# EAGLE design monitor-board (EAGLE 9.2.2)
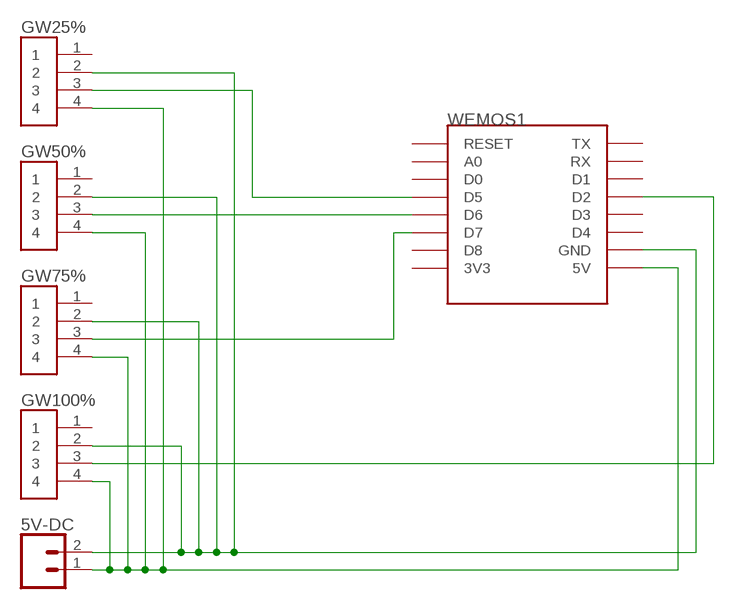
[diagram p0: schematic, sheet 1]

## Parts
5V-DC  CONN_02  [1X02]
GW25%  B4B-XH-A(LF)(SN)  [JST_B4B-XH-A(LF)(SN)]
GW50%  B4B-XH-A(LF)(SN)  [JST_B4B-XH-A(LF)(SN)]
GW75%  B4B-XH-A(LF)(SN)  [JST_B4B-XH-A(LF)(SN)]
GW100%  B4B-XH-A(LF)(SN)  [JST_B4B-XH-A(LF)(SN)]
WEMOS1  WEMOS-D1-MINI  [WEMOS-D1-MINI]

## Nets
N$1: 5V-DC.1 GW25%.4 GW50%.4 GW75%.4 GW100%.4 WEMOS1.5V
N$2: 5V-DC.2 GW25%.2 GW50%.2 GW75%.2 GW100%.2 WEMOS1.GND
N$3: GW25%.3 WEMOS1.D5
N$11: GW100%.3 WEMOS1.D2
N$12: GW75%.3 WEMOS1.D7
N$13: GW50%.3 WEMOS1.D6
Unconnected: GW25%.1 GW50%.1 GW75%.1 GW100%.1 WEMOS1.3V3 WEMOS1.A0 WEMOS1.D0 WEMOS1.D1 WEMOS1.D3 WEMOS1.D4 WEMOS1.D8 WEMOS1.RESET WEMOS1.RX WEMOS1.TX

## Library data of the parts
5V-DC = SparkFun-Connectors:CONN_02: Multi connection point. Often used as Generic Header-pin footprint for 0.1 inch spaced/style header connections On any of the 0.1 inch spaced packages, you can populate with these: Break Away Headers - Straight <https://www.sparkfun.com/products/116> (PRT-00116) Break Away Male Headers - Right Angle <https://www.sparkfun.com/products/553> (PRT-00553) Female Headers <https://www.sparkfun.com/products/115> (PRT-00115) Break Away Headers - Machine Pin <https://www.sparkfun.com/products/117> (PRT-00117) Break Away Female Headers - Swiss Machine Pin <https://www.sparkfun.com/products/743> (PRT-00743) For SCREWTERMINALS and SPRING TERMINALS visit here: Screw Terimnals on SparkFun.com <https://www.sparkfun.com/search/results?term=Screw+Terminals> (5mm/3.5mm/2.54mm spacing) This device is also useful as a general connection point to wire up your design to another part of your project. Our various solder wires solder well into these plated through hole pads. Hook-Up Wire - Assortment (Stranded, 22 AWG) <https://www.sparkfun.com/products/11375> (PRT-11375) Hook-Up Wire - Assortment (Solid Core, 22 AWG) <https://www.sparkfun.com/products/11367> (PRT-11367) View the entire wire category on our website here <https://www.sparkfun.com/categories/141> Special notes: Molex polarized connector foot print use with: PRT-08233 with associated crimp pins and housings. 2.54_SCREWTERM for use with PRT-10571. 3.5mm Screw Terminal footprints for PRT-08084 5mm Screw Terminal footprints for use with PRT-08432
GW25% GW50% GW75% GW100% = B4B-XH-A_LF__SN_:B4B-XH-A(LF)(SN): XH Series 4 Position 2.5 mm Pitch Through Hole Crimp Top Entry Shrouded Header; DESCRIPTION: Connector Header Through Hole 4 position 0.098 _2.50mm_; DIGI-KEY_PART_NUMBER: 455-2249-ND; DIGI-KEY_PURCHASE_URL: https://www.digikey.com/product-detail/en/jst-sales-america-inc/B4B-XH-A_LF__SN_/455-2249-ND/1651047?utm_source=snapeda&utm_medium=aggregator&utm_campaign=symbol; MF: JST Sales; MP: B4B-XH-A_LF__SN_; PACKAGE: None
WEMOS1 = esp8266modules:WEMOS-D1-MINI: WeMos.cc D1 mini ESP8266 module

## Net classes
0 default: clearance 0.635 mm

## Board
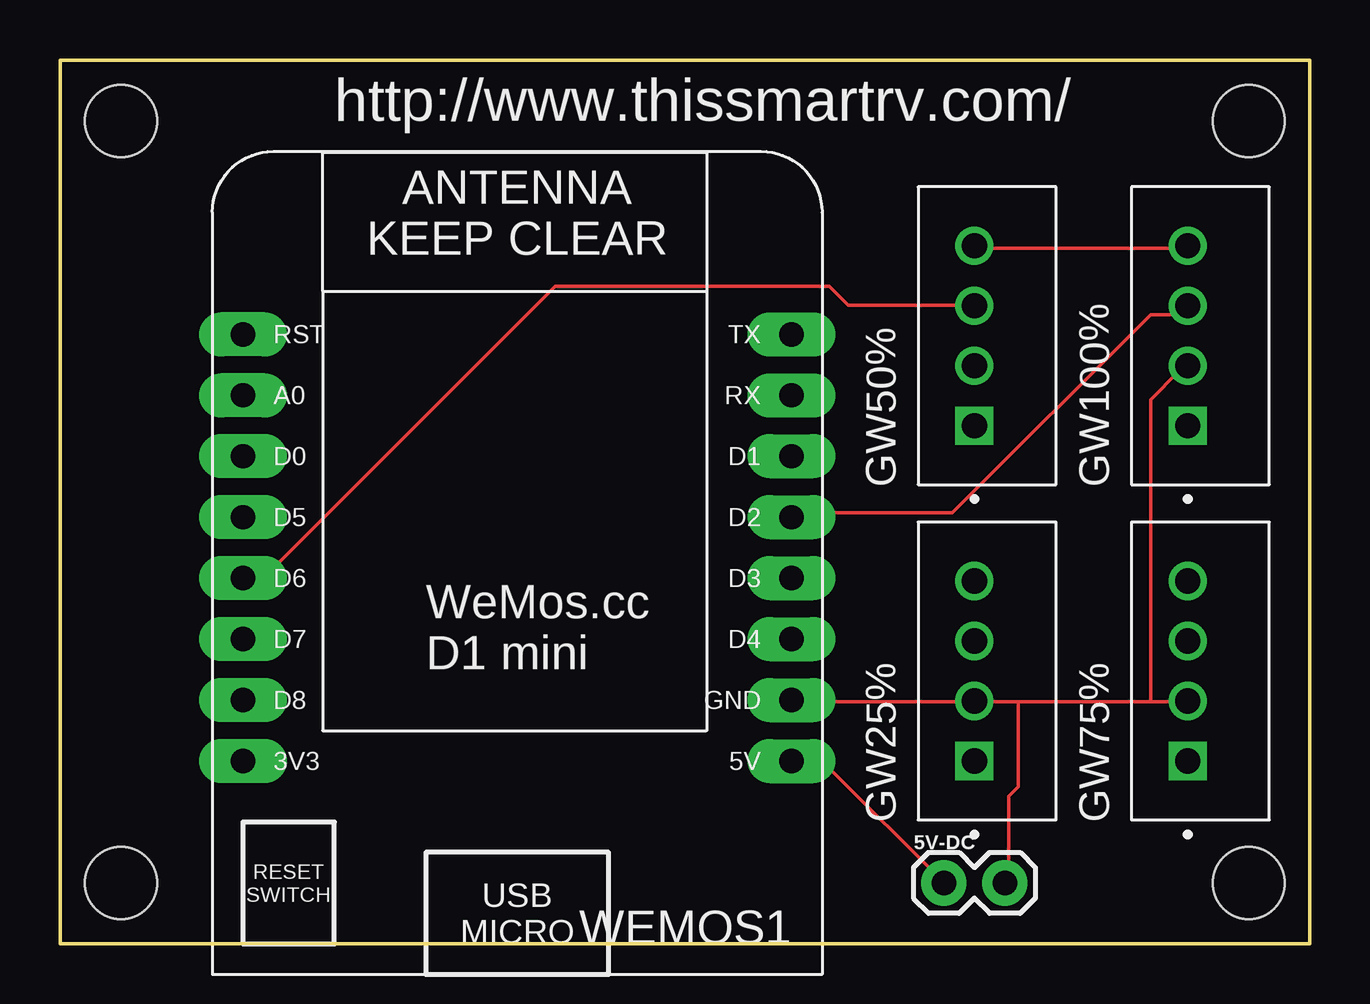
[diagram p1: board, top side]
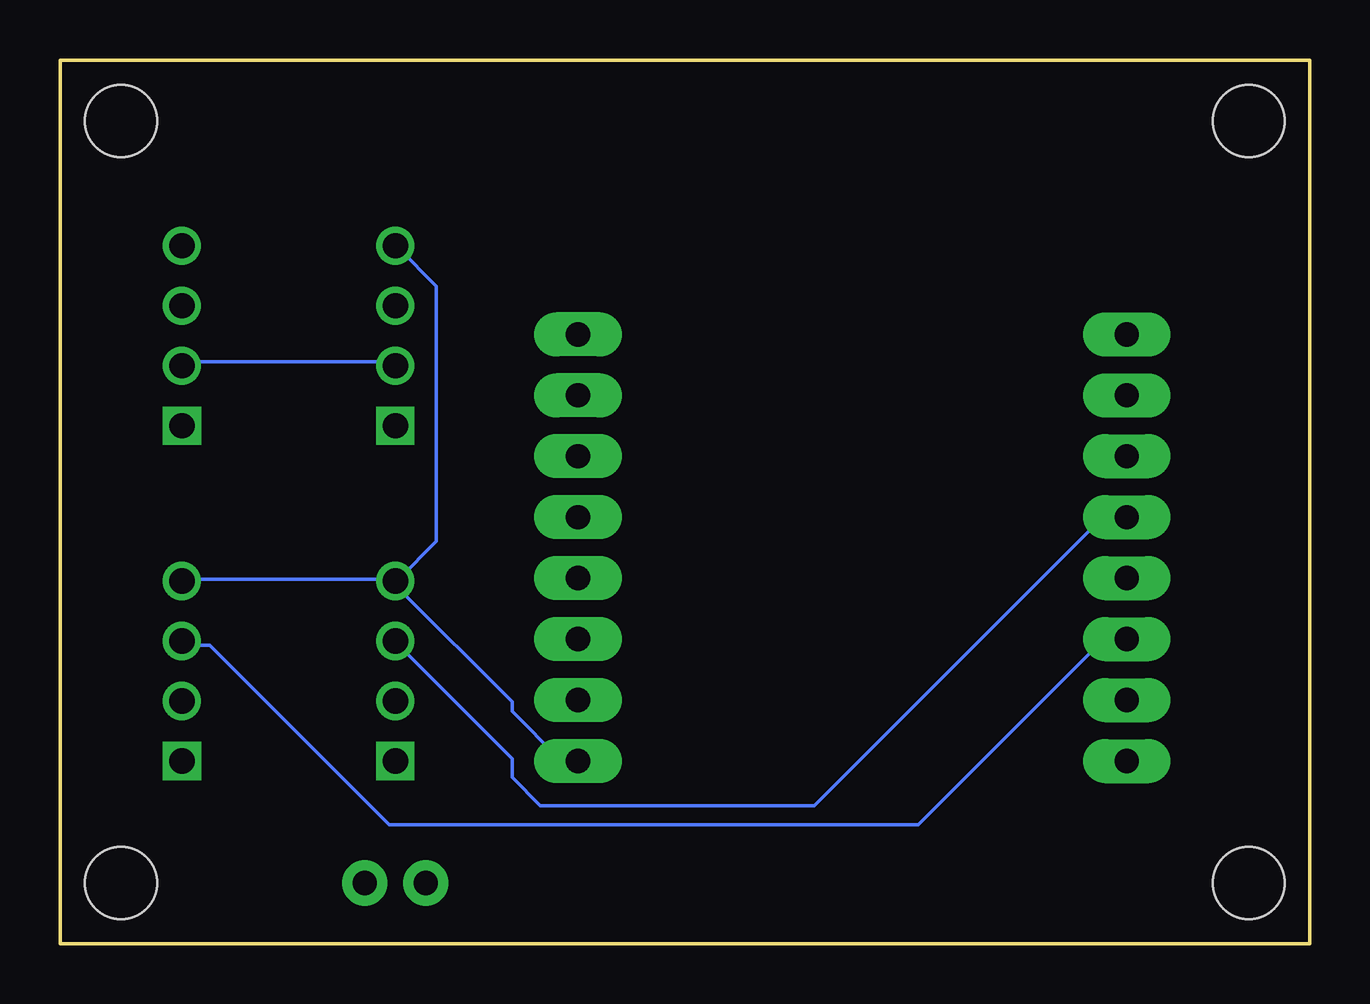
[diagram p2: board, bottom side, seen from below]

Size 52.07 x 36.83 mm. Coordinates in mm from the lower left corner, seen from the top.
Outline: 0,36.83 0,0 52.07,0 52.07,36.83 0,36.83
Copper layers (1*16): Top 0.035mm / dielectric 1.5mm / Bottom 0.035mm
Design rules "default": minimum track width 6mil, minimum drill 0.35mm, track to track 6mil, track to pad 6mil, pad to pad 6mil, via to via 6mil, smd to smd 6mil, copper to edge 40mil, drill to drill 6mil, minimum pad ring 10mil, minimum via ring 8mil, stop-mask expansion 4mil, vias tented up to drill 0mil, thermal gap 10mil
Holes 3 mm at 2.54,34.29 49.53,34.29 49.53,2.54 2.54,2.54

### Footprints (pad centres in the part's own frame; a part is rotated, then mirrored left to right if it is on the bottom)
1X02 = drill 1.016 pad 1.88: 1 0,0; 2 2.54,0
JST_B4B-XH-A(LF)(SN) = drill 1.06 square: 1 0,0 | drill 1.06: 2 2.5,0; 3 5,0; 4 7.5,0
WEMOS-D1-MINI = drill 1.016 pad 1.829 long: 3V3 -10.16,-10.16; 5V 12.7,-10.16; A0 -10.16,5.08; D0 -10.16,2.54; D1 12.7,2.54; D2 12.7,0; D3 12.7,-2.54; D4 12.7,-5.08; D5 -10.16,0; D6 -10.16,-2.54; D7 -10.16,-5.08; D8 -10.16,-7.62; GND 12.7,-7.62; RESET -10.16,7.62; RX 12.7,5.08; TX 12.7,7.62

### Placement (x,y rotation side)
5V-DC  36.83,2.54 0 top
GW25%  38.1,7.62 90 top
GW50%  38.1,21.59 90 top
GW75%  46.99,7.62 90 top
GW100%  46.99,21.59 90 top
WEMOS1  17.78,17.78 0 top

### Tracks (layer width: path | path; a pad name or v marks a point on that pad's centre or on a via)
N$1
  Top 0.152: GW50%.4 38.35,28.98 46.62,28.98 GW100%.4 | WEMOS1.5V 30.48,7.33 32.05,7.33 36.78,2.6 5V-DC.1
  Bottom 0.152: GW25%.4 38.35,15.2 46.62,15.2 GW75%.4 | GW25%.4 37.96,14.81 33.24,10.08 33.24,9.69 31.27,7.72 30.48,7.72 WEMOS1.5V | GW50%.4 37.96,28.98 36.39,27.41 36.39,16.78 37.96,15.2 GW25%.4
N$2
  Top 0.152: WEMOS1.GND 30.48,10.08 37.96,10.08 GW25%.2 38.35,10.08 39.93,10.08 | 39.93,10.08 45.44,10.08 | 45.44,10.08 46.62,10.08 GW75%.2 | 39.93,10.08 39.93,6.54 39.53,6.15 39.53,2.6 5V-DC.2 | 45.44,10.08 45.44,22.68 46.62,23.86 GW100%.2
  Bottom 0.152: GW50%.2 38.35,24.26 46.62,24.26 GW100%.2
N$3
  Bottom 0.152: GW25%.3 37.96,12.45 33.24,7.72 33.24,6.93 32.05,5.75 20.64,5.75 8.83,17.56 7.64,17.56 WEMOS1.D5
N$11
  Top 0.152: GW100%.3 46.62,26.22 45.44,26.22 37.17,17.96 30.48,17.96 WEMOS1.D2
N$12
  Bottom 0.152: GW75%.3 46.62,12.45 45.83,12.45 38.35,4.97 16.31,4.97 8.83,12.45 7.64,12.45 WEMOS1.D7
N$13
  Top 0.152: GW50%.3 37.96,26.62 32.84,26.62 32.05,27.41 20.64,27.41 8.83,15.6 7.64,15.6 WEMOS1.D6

### Text on the board
tPlace: http://www.thissmartrv.com/